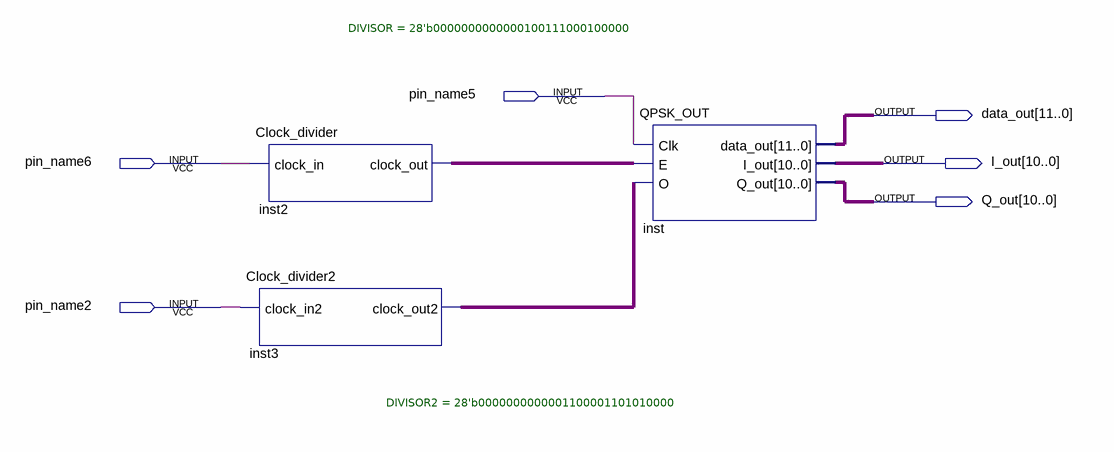
[diagram p0: schematic sheet]
// Quartus schematic QPSK_OUT_BLOCK.bdf as structural Verilog: 3 symbols, 6 pins
module QPSK_OUT_BLOCK (
  input  pin_name5,
  input  pin_name6,
  input  pin_name2,
  output [11:0] data_out,
  output [10:0] I_out,
  output [10:0] Q_out
);

  wire inst2_clock_out, inst3_clock_out2;

  Clock_divider #(.DIVISOR(28'b0000000000000100111000100000)) inst2 (.clock_in(pin_name6), .clock_out(inst2_clock_out));
  Clock_divider2 #(.DIVISOR2(28'b0000000000001100001101010000)) inst3 (
    .clock_in2(pin_name2), .clock_out2(inst3_clock_out2));
  QPSK_OUT inst (
    .Clk(pin_name5), .E(inst2_clock_out), .O(inst3_clock_out2), .data_out(data_out), .I_out(I_out),
    .Q_out(Q_out));
endmodule
